# Altium schematic sheet MCU.SchDoc
size A
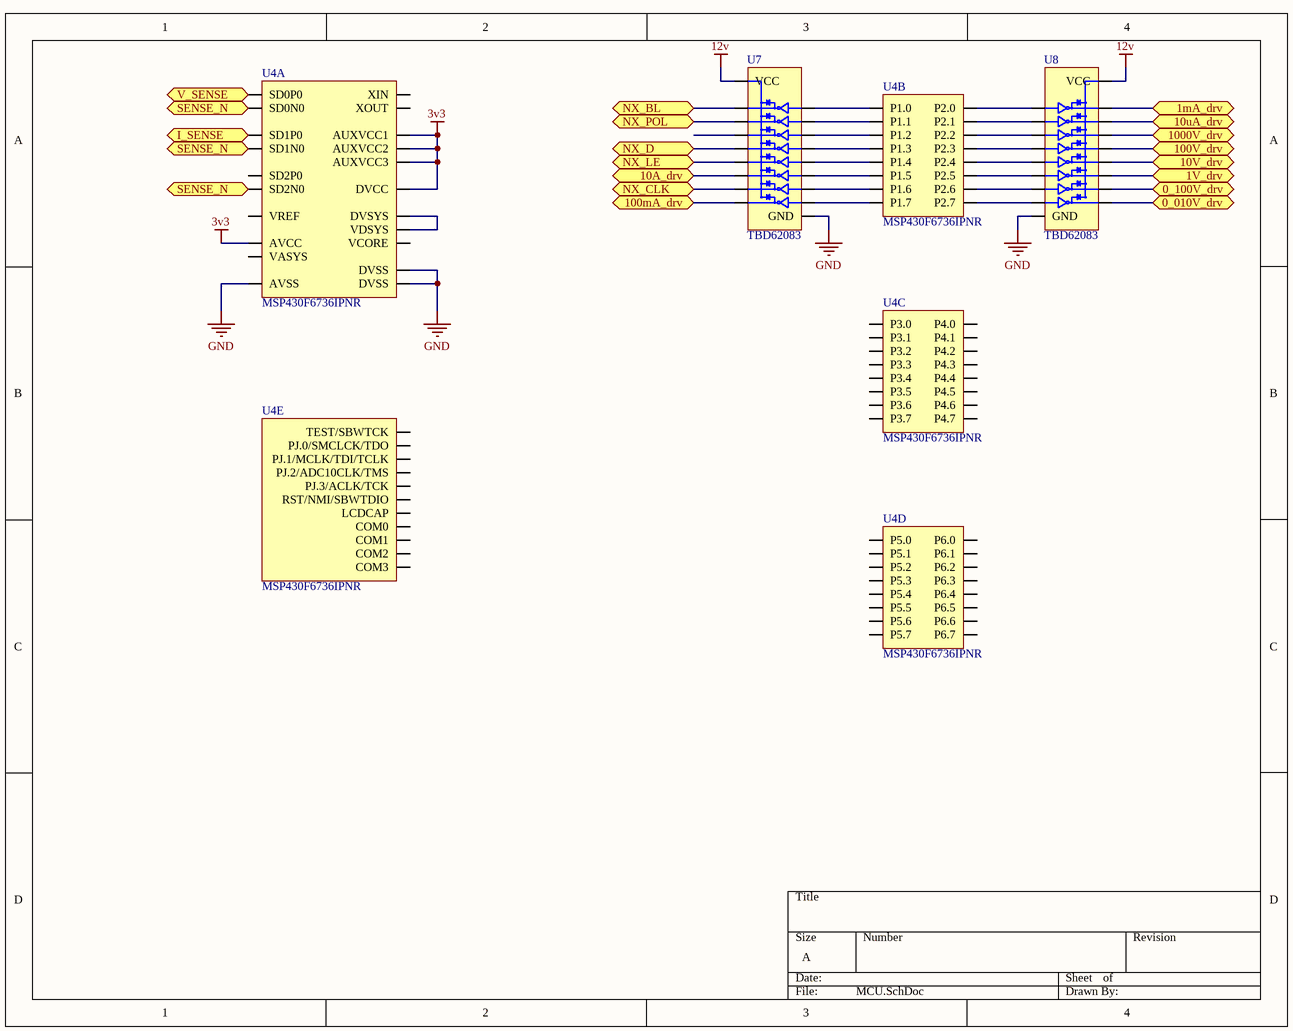
[diagram p0: MCU.SchDoc]

## Parts
U4  MSP430F6736IPNR  [80-LQFP]  (parts A,B,C,D,E of 5)
U7  TBD62083  [18-SOIC]
U8  TBD62083  [18-SOIC]

## Ports
0_010V_drv, 0_100V_drv, 1mA_drv, 1V_drv, 10A_drv, 10uA_drv, 10V_drv, 100mA_drv, 100V_drv, 1000V_drv, I_SENSE, NX_BL, NX_CLK, NX_D, NX_LE, NX_POL, SENSE_N, V_SENSE

## Nets
3v3: U4.9(AVCC) U4.15(AUXVCC2) U4.16(AUXVCC1) U4.18(DVCC) U4.23(AUXVCC3)
12v: U7.10(VCC) U8.10(VCC)
GND: U4.8(AVSS) U4.19(DVSS) U4.60(DVSS) U7.9(GND) U8.9(GND)
0_010V_drv: U8.11(O8) ; port 0_010V_drv
0_100V_drv: U8.12(O7) ; port 0_100V_drv
1mA_drv: U8.18(O1) ; port 1mA_drv
1V_drv: U8.13(O6) ; port 1V_drv
10A_drv: U7.13(O6) ; port 10A_drv
10uA_drv: U8.17(O2) ; port 10uA_drv
10V_drv: U8.14(O5) ; port 10V_drv
100mA_drv: U7.11(O8) ; port 100mA_drv
100V_drv: U8.15(O4) ; port 100V_drv
1000V_drv: U8.16(O3) ; port 1000V_drv
I_SENSE: U4.3(SD1P0) ; port I_SENSE
NX_BL: U7.18(O1) ; port NX_BL
NX_CLK: U7.12(O7) ; port NX_CLK
NX_D: U7.15(O4) ; port NX_D
NX_LE: U7.14(O5) ; port NX_LE
NX_POL: U7.17(O2) ; port NX_POL
SENSE_N: U4.2(SD0N0) U4.4(SD1N0) U4.6(SD2N0) ; port SENSE_N
V_SENSE: U4.1(SD0P0) ; port V_SENSE
NetU4_11: U4.11(P1.0) U7.1(I1)
NetU4_12: U4.12(P1.1) U7.2(I2)
NetU4_13: U4.13(P1.2) U7.3(I3)
NetU4_14: U4.14(P1.3) U7.4(I4)
NetU4_17: U4.17(VDSYS) U4.59(DVSYS)
NetU4_24: U4.24(P1.4) U7.5(I5)
NetU4_25: U4.25(P1.5) U7.6(I6)
NetU4_31: U4.31(P1.6) U7.7(I7)
NetU4_32: U4.32(P1.7) U7.8(I8)
NetU4_33: U4.33(P2.0) U8.1(I1)
NetU4_34: U4.34(P2.1) U8.2(I2)
NetU4_35: U4.35(P2.2) U8.3(I3)
NetU4_36: U4.36(P2.3) U8.4(I4)
NetU4_37: U4.37(P2.4) U8.5(I5)
NetU4_38: U4.38(P2.5) U8.6(I6)
NetU4_39: U4.39(P2.6) U8.7(I7)
NetU4_40: U4.40(P2.7) U8.8(I8)

Not connected (* = marked no-connect by the designer): U4 5(SD2P0) 7(VREF) 10(VASYS) 20(VCORE) 21(XIN) 22(XOUT) 26(LCDCAP) 27(COM0) 28(COM1) 29(COM2) 30(COM3) 41(P3.0) 42(P3.1) 43(P3.2) 44(P3.3) 45(P3.4) 46(P3.5) 47(P3.6) 48(P3.7) 49(P4.0) 50(P4.1) 51(P4.2) 52(P4.3) 53(P4.4) 54(P4.5) 55(P4.6) 56(P4.7) 57(P5.0) 58(P5.1) 61(P5.2) 62(P5.3) 63(P5.4) 64(P5.5) 65(P5.6) 66(P5.7) 67(P6.0) 68(P6.1) 69(P6.2) 70(P6.3) 71(P6.4) 72(P6.5) 73(P6.6) 74(P6.7) 75(TEST/SBWTCK) 76(PJ.0/SMCLCK/TDO) 77(PJ.1/MCLK/TDI/TCLK) 78(PJ.2/ADC10CLK/TMS) 79(PJ.3/ACLK/TCK) 80(RST/NMI/SBWTDIO); U7 16(O3)

## Library data of the parts
U4 = MSP430 F6736IPNR: IC MCU 16BIT 128KB FLASH 80LQFP; Supplier 1: Digi-Key; Supplier Part Number 1: 296-30130-1-ND; Supplier 2: Digi-Key; Supplier Part Number 2: 296-30427-ND
U7 U8 = TBD62083: IC LOAD SWITCH 8CH 0.5A 18SOP; Supplier 1: Digi-Key; Supplier Part Number 1: TBD62083AFWGELCT-ND